# EAGLE design Pyr0-Piezo_Direct-Extruder-FFC-Breakout_2.1.1 (EAGLE 9.4.2)
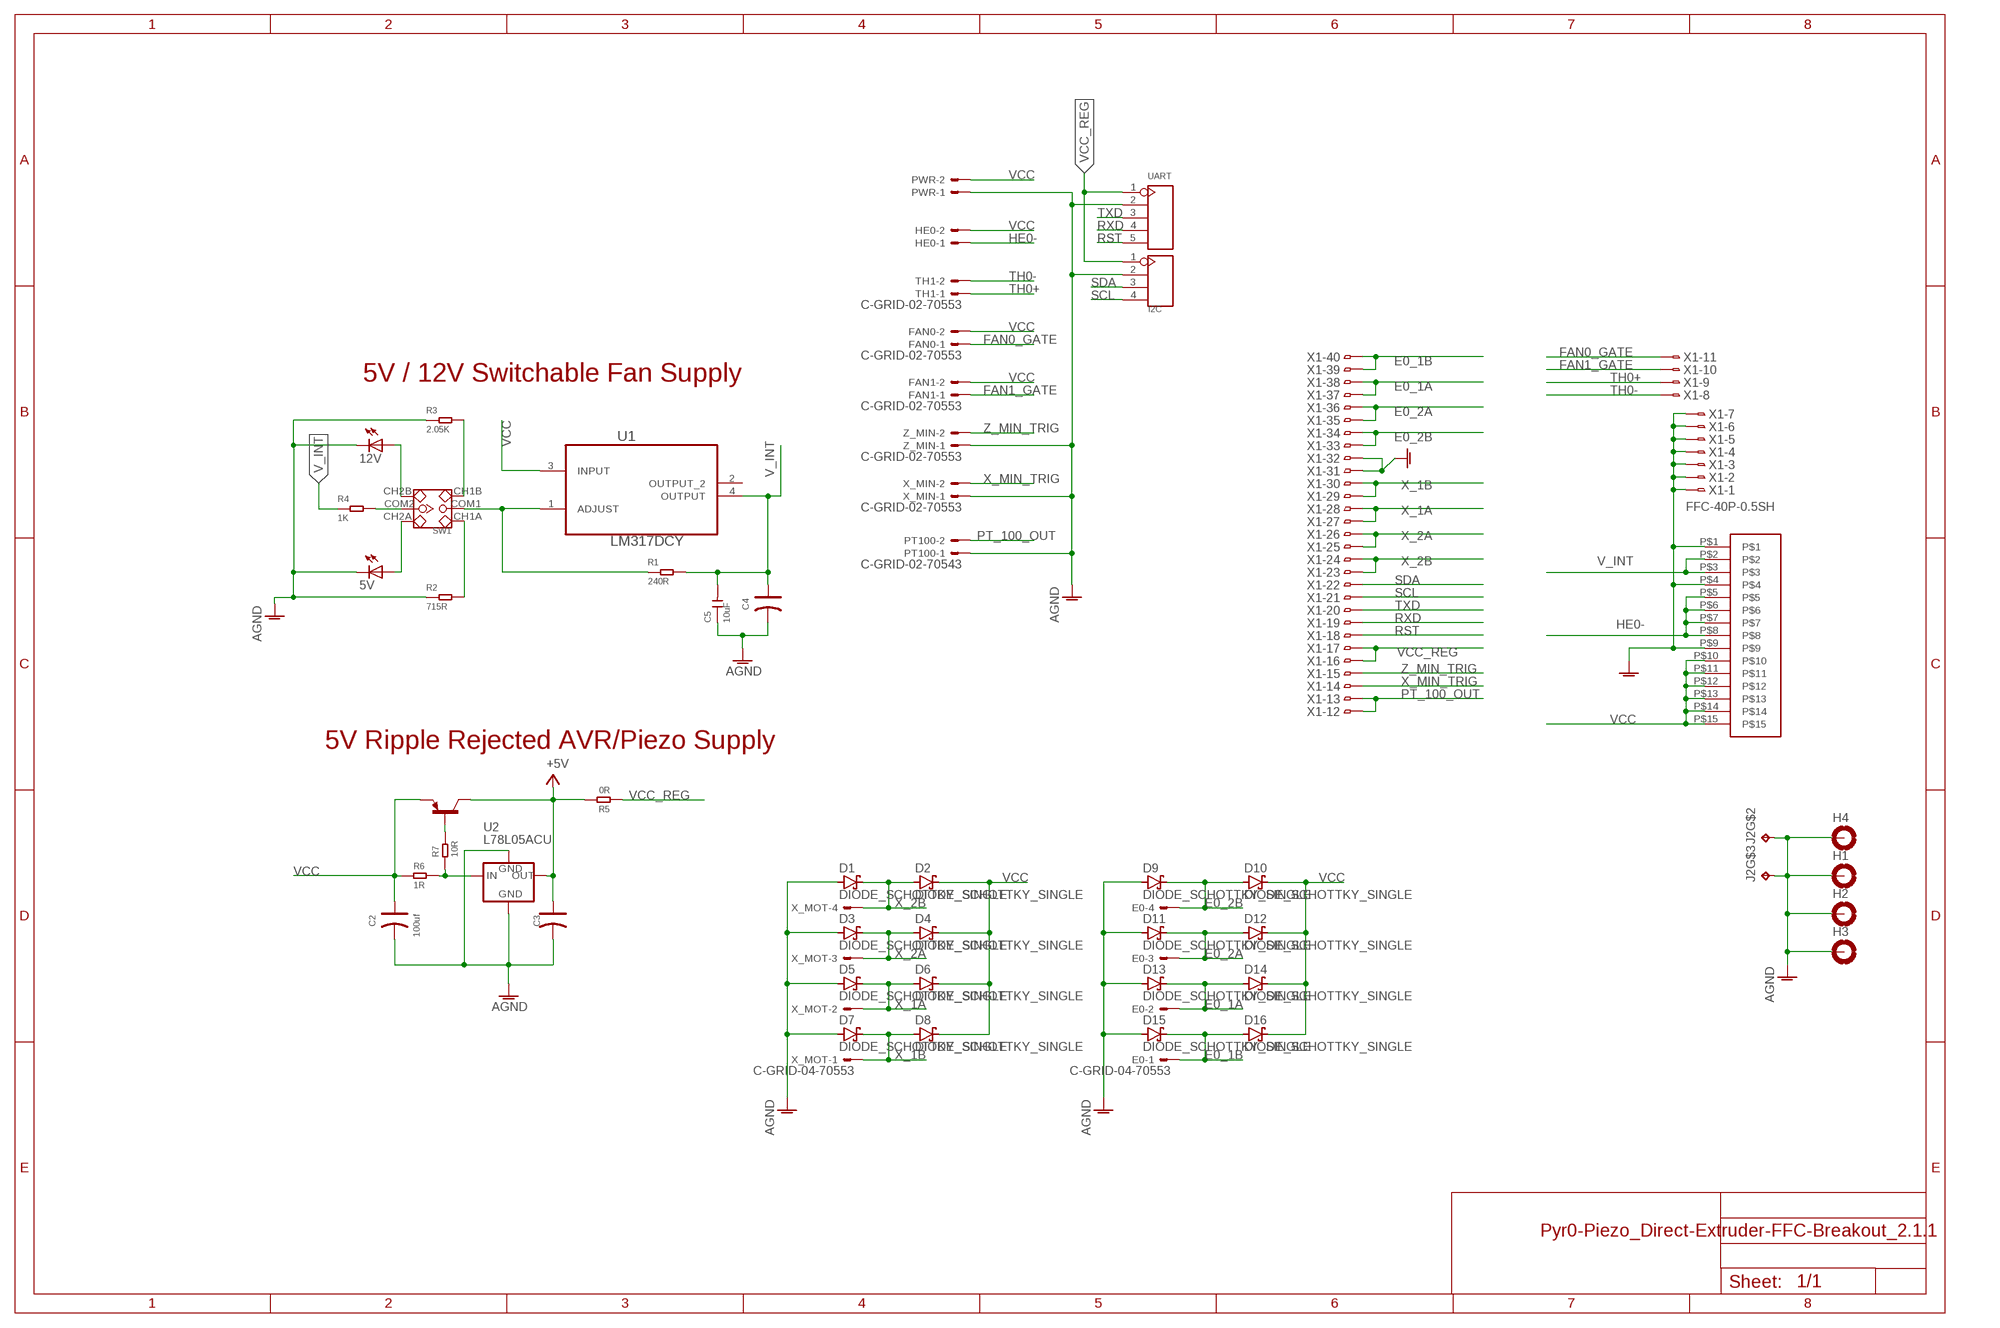
[diagram p0: schematic, sheet 1]

## Parts
5V  LEDCHIP-LED0805  [CHIP-LED0805]
12V  LEDCHIP-LED0805  [CHIP-LED0805]
C2  100uf  DIP-ALUMINUM-100UF-16V(D5-H7MM)LEFT  [ALU-C-D5.3MM_LEFT]
C3  100uf  DIP-ALUMINUM-100UF-16V(D5-H7MM)RIGHT  [ALU-C-D5.3MM_RIGHT]
C4  100uf  DIP-ALUMINUM-100UF-16V(D5-H7MM)RIGHT  [ALU-C-D5.3MM_RIGHT]
C5  10uF  SEEED-CAPACITOR_CERAMIC-10UF-25V-10%-X5R(0805)CAP_0805-3D  [CAPC2012X130]
D1  DIODE_SCHOTTKY_SINGLE  [DO-214AC]
D2  DIODE_SCHOTTKY_SINGLE  [DO-214AC]
D3  DIODE_SCHOTTKY_SINGLE  [DO-214AC]
D4  DIODE_SCHOTTKY_SINGLE  [DO-214AC]
D5  DIODE_SCHOTTKY_SINGLE  [DO-214AC]
D6  DIODE_SCHOTTKY_SINGLE  [DO-214AC]
D7  DIODE_SCHOTTKY_SINGLE  [DO-214AC]
D8  DIODE_SCHOTTKY_SINGLE  [DO-214AC]
D9  DIODE_SCHOTTKY_SINGLE  [DO-214AC]
D10  DIODE_SCHOTTKY_SINGLE  [DO-214AC]
D11  DIODE_SCHOTTKY_SINGLE  [DO-214AC]
D12  DIODE_SCHOTTKY_SINGLE  [DO-214AC]
D13  DIODE_SCHOTTKY_SINGLE  [DO-214AC]
D14  DIODE_SCHOTTKY_SINGLE  [DO-214AC]
D15  DIODE_SCHOTTKY_SINGLE  [DO-214AC]
D16  DIODE_SCHOTTKY_SINGLE  [DO-214AC]
E0  C-GRID-04-70553  [70553-04]
FAN0  C-GRID-02-70553  [70553-02]
FAN1  C-GRID-02-70553  [70553-02]
H1  HOLES_MOUNT-PAD-ROUND3.2  [HOLES_3,2-PAD]
H2  HOLES_MOUNT-PAD-ROUND3.2  [HOLES_3,2-PAD]
H3  HOLES_MOUNT-PAD-ROUND3.2  [HOLES_3,2-PAD]
H4  HOLES_MOUNT-PAD-ROUND3.2  [HOLES_3,2-PAD]
HE0  KK-156-2  [KK-156-2]
I2C  SEEED-CONNECTOR_DIP-BLACK-FEMALE-HEADER-VERT(4P-2.54)JST-2.54MM_4P  [HDRVR4W64P254_1X4_1016X254X575B]
J2  FFC-15P-1MM  [FFC-15P-1MM]
PT100  C-GRID-02-70543  [70543-02]
PWR  KK-156-2  [KK-156-2]
Q2  MMBT2907ALT1-PNP-SOT23-BEC  [SOT23-BEC]
R1  240R  SEEED-RESISTOR_SMD-RES-1.5K-1%-1/10W(0603)DETAILED_MODEL  [SEEED-RESISTOR_R0603]
R2  715R  SEEED-RESISTOR_SMD-RES-1.5K-1%-1/10W(0603)DETAILED_MODEL  [SEEED-RESISTOR_R0603]
R3  2.05K  SEEED-RESISTOR_SMD-RES-1.5K-1%-1/10W(0603)DETAILED_MODEL  [SEEED-RESISTOR_R0603]
R4  1K  SEEED-RESISTOR_SMD-RES-1.5K-1%-1/10W(0603)DETAILED_MODEL  [SEEED-RESISTOR_R0603]
R5  0R  SMD-RES-2K-5%-1/8W(0805)  [R0805]
R6  1R  SMD-RES-2K-5%-1/8W(0805)  [R0805]
R7  10R  SMD-RES-2K-5%-1/8W(0805)  [R0805]
SW1  SEEED-SWITCH_DIP-TOGGLE-SWITCH-2CH-(2X3P-2.54)DPDT_254_6P_UPDATE  [SEEED-SWITCH_SW6-2.54-9.0X3.5X3.2+2.0MM]
TH1  C-GRID-02-70553  [70553-02]
U1  LM317DCY  [SOT230P700X180-4N]
U2  L78L05ACU  [SOT89]
UART  JST-2.54MM_5P-2.54JST_2.54MM_5P_F  [HDRVR5W64P254_1X5_1270X254X575B]
X1  FFC-40P-0.5SH  [FH12-40S-0.5SH]
X_MIN  C-GRID-02-70553  [70553-02]
X_MOT  C-GRID-04-70553  [70553-04]
Z_MIN  C-GRID-02-70553  [70553-02]

## Nets
5V_ADJ: R2.2 SW1.CH1A
5V_LED: 5V.A SW1.CH2A
12V_ADJ: R3.2 SW1.CH1B
12V_LED: 12V.A SW1.CH2B
+5V: C3.+ Q2.C R5.2 U2.1(OUT)
AGND: 5V.C 12V.C C2.- C3.- C4.- C5.1 D1.A D3.A D5.A D7.A D9.A D11.A D13.A D15.A H1.B3,2(MOUNT) H2.B3,2(MOUNT) H3.B3,2(MOUNT) H4.B3,2(MOUNT) I2C.2 J2.P$1 J2.P$4 J2.P$9 J2.P$16(TP) J2.P$17(TP) PT100.1 PWR.1 R2.1 R3.1 U2.2(GND) U2.PAD UART.2 X1.1 X1.2 X1.3 X1.4 X1.5 X1.6 X1.7 X1.31 X1.32 X_MIN.1 Z_MIN.1
BYP_GATE: Q2.B R7.2
E0_1A: D13.C D14.A E0.2 X1.37 X1.38
E0_1B: D15.C D16.A E0.1 X1.39 X1.40
E0_2A: D11.C D12.A E0.3 X1.35 X1.36
E0_2B: D9.C D10.A E0.4 X1.33 X1.34
FAN0_GATE: FAN0.1 X1.11
FAN1_GATE: FAN1.1 X1.10
HE0-: HE0.1 J2.P$5 J2.P$6 J2.P$7 J2.P$8
LED_R: R4.2 SW1.COM2
LM317_VADJ: R1.1 SW1.COM1 U1.1(ADJUST)
PT_100_OUT: PT100.2 X1.12 X1.13
RST: UART.5 X1.18
RXD: UART.4 X1.19
SCL: I2C.4 X1.21
SDA: I2C.3 X1.22
TH0+: TH1.1 X1.9
TH0-: TH1.2 X1.8
TXD: UART.3 X1.20
V_INT: C4.+ C5.2 J2.P$2 J2.P$3 R1.2 R4.1 U1.4(OUTPUT)
VCC: C2.+ D2.C D4.C D6.C D8.C D10.C D12.C D14.C D16.C FAN0.2 FAN1.2 HE0.2 J2.P$10 J2.P$11 J2.P$12 J2.P$13 J2.P$14 J2.P$15 PWR.2 Q2.E R6.1 U1.3(INPUT)
VCC_REG: I2C.1 R5.1 UART.1 X1.16 X1.17
VREG_IN: R6.2 R7.1 U2.3(IN)
X_1A: D5.C D6.A X1.27 X1.28 X_MOT.2
X_1B: D7.C D8.A X1.29 X1.30 X_MOT.1
X_2A: D3.C D4.A X1.25 X1.26 X_MOT.3
X_2B: D1.C D2.A X1.23 X1.24 X_MOT.4
X_MIN_TRIG: X1.14 X_MIN.2
Z_MIN_TRIG: X1.15 Z_MIN.2
Unconnected: U1.2(OUTPUT_2)

## Notes on the sheet
- 5V / 12V Switchable Fan Supply
- 5V Ripple Rejected AVR/Piezo Supply

## Library data of the parts
5V 12V = PiezoFFC:LED: LED OSRAM: - CHIPLED LG R971, LG N971, LY N971, LG Q971, LY Q971, LO R971, LY R971 LH N974, LH R974 LS Q976, LO Q976, LY Q976 LO Q996 - Hyper CHIPLED LW Q18S LB Q993, LB Q99A, LB R99A - SideLED LS A670, LO A670, LY A670, LG A670, LP A670 LB A673, LV A673, LT A673, LW A673 LH A674 LY A675 LS A676, LA A676, LO A676, LY A676, LW A676 LS A679, LY A679, LG A679 - Hyper Micro SIDELED® LS Y876, LA Y876, LO Y876, LY Y876 LT Y87S - SmartLED LW L88C, LW L88S LB L89C, LB L89S, LG L890 LS L89K, LO L89K, LY L89K LS L896, LA L896, LO L896, LY L896 - TOPLED LS T670, LO T670, LY T670, LG T670, LP T670 LSG T670, LSP T670, LSY T670, LOP T670, LYG T670 LG T671, LOG T671, LSG T671 LB T673, LV T673, LT T673, LW T673 LH T674 LS T676, LA T676, LO T676, LY T676, LB T676, LH T676, LSB T676, LW T676 LB T67C, LV T67C, LT T67C, LS T67K, LO T67K, LY T67K, LW E67C LS E67B, LA E67B, LO E67B, LY E67B, LB E67C, LV E67C, LT E67C LW T67C LS T679, LY T679, LG T679 LS T770, LO T770, LY T770, LG T770, LP T770 LB T773, LV T773, LT T773, LW T773 LH T774 LS E675, LA E675, LY E675, LS T675 LS T776, LA T776, LO T776, LY T776, LB T776 LHGB T686 LT T68C, LB T68C - Hyper Mini TOPLED® LB M676 - Mini TOPLED Santana® LG M470 LS M47K, LO M47K, LY M47K Source: http://www.osram.convergy.de LUXEON: - LUMILED® LXK2-PW12-R00, LXK2-PW12-S00, LXK2-PW14-U00, LXK2-PW14-V00 LXK2-PM12-R00, LXK2-PM12-S00, LXK2-PM14-U00 LXK2-PE12-Q00, LXK2-PE12-R00, LXK2-PE12-S00, LXK2-PE14-T00, LXK2-PE14-U00 LXK2-PB12-K00, LXK2-PB12-L00, LXK2-PB12-M00, LXK2-PB14-N00, LXK2-PB14-P00, LXK2-PB14-Q00 LXK2-PR12-L00, LXK2-PR12-M00, LXK2-PR14-Q00, LXK2-PR14-R00 LXK2-PD12-Q00, LXK2-PD12-R00, LXK2-PD12-S00 LXK2-PH12-R00, LXK2-PH12-S00 LXK2-PL12-P00, LXK2-PL12-Q00, LXK2-PL12-R00 Source: www.luxeon.com KINGBRIGHT: KA-3528ASYC Source: www.kingbright.com
C2 = PiezoFFC:DIP-ALUMINUM-100UF-16V(D5-H7MM): 302030031; MPN: KS 100uF/16V
C3 C4 = PiezoFFC:DIP-ALUMINUM-100UF-16V(D5-H7MM): 302030031
C5 = PiezoFFC:SEEED-CAPACITOR_CERAMIC-10UF-25V-10%-X5R(0805): 302010178
D1-D16 = PiezoFFC:DIODE_SCHOTTKY_SINGLE
E0 X_MOT = PiezoFFC:C-GRID-04: CONNECTOR wire to board 2.54 mm (0.100") pitch header; MF: MOLEX; OC_FARNELL: unknown; OC_NEWARK: unknown
FAN0 FAN1 PT100 TH1 X_MIN Z_MIN = PiezoFFC:C-GRID-02: CONNECTOR wire to board 2.54 mm (0.100") pitch header; MF: MOLEX; OC_FARNELL: unknown; OC_NEWARK: unknown
H1-H4 = PiezoFFC:HOLES_MOUNT-PAD-ROUND: MOUNTING PAD, round
HE0 PWR = PiezoFFC:KK-156-2: KK 156 HEADER Source: http://www.molex.com/pdm_docs/sd/026604100_sd.pdf; MF: MOLEX; OC_FARNELL: unknown; OC_NEWARK: unknown
I2C = PiezoFFC:SEEED-CONNECTOR_DIP-BLACK-FEMALE-HEADER-VERT(4P-2.54): 320030017
J2 = PiezoFFC:FFC-15P-1MM
Q2 = PiezoFFC:*-PNP-: PNP Transistror
R1-R4 = PiezoFFC:SEEED-RESISTOR_SMD-RES-1.5K-1%-1/10W(0603): 301010189
R5-R7 = PiezoFFC:SMD-RES-2K-5%-1/8W(0805): 301010318; MPN: RC0805JR-072KL; VALUE: 2K
SW1 = PiezoFFC:SEEED-SWITCH_DIP-TOGGLE-SWITCH-2CH-(2X3P-2.54): 311010004
U1 = PiezoFFC:LM317DCY: IC ADJ LINEAR REG 1.25V TO 37V; AVAILABILITY: Unavailable; DESCRIPTION: IC Regulator LM317/SOT223/LM317DCY TEXAS INSTRUMENT RoHS Ampere=1.5 SOT223; MF: Texas Instruments; MP: LM317DCY; PACKAGE: SOT-223-4 Texas Instruments; PRICE: None
U2 = PiezoFFC:L78L05ACU: 5V Positive voltage regulator SMD SOT89 Package; AVAILABILITY: Unavailable; DESCRIPTION: Voltage regulator; fixed; 5V; 0.1A; SOT89; SMD; Package: reel, tape; MF: STMicroelectronics; MP: L78L05ACU-TR; PACKAGE: None; PRICE: None
UART = PiezoFFC:JST-2.54MM_5P-2.54
X1 = PiezoFFC:FFC-40P-0.5S: 0.5mm Pitch Connectors For FPC/FFC Source: Data sheet <http://www.hirose.co.jp/cataloge_hp/e58605370.pdf>; MPN: FH12-40S-0.5SH(55); OC_FARNELL: 1324556; OC_NEWARK: 34M6178

## Board
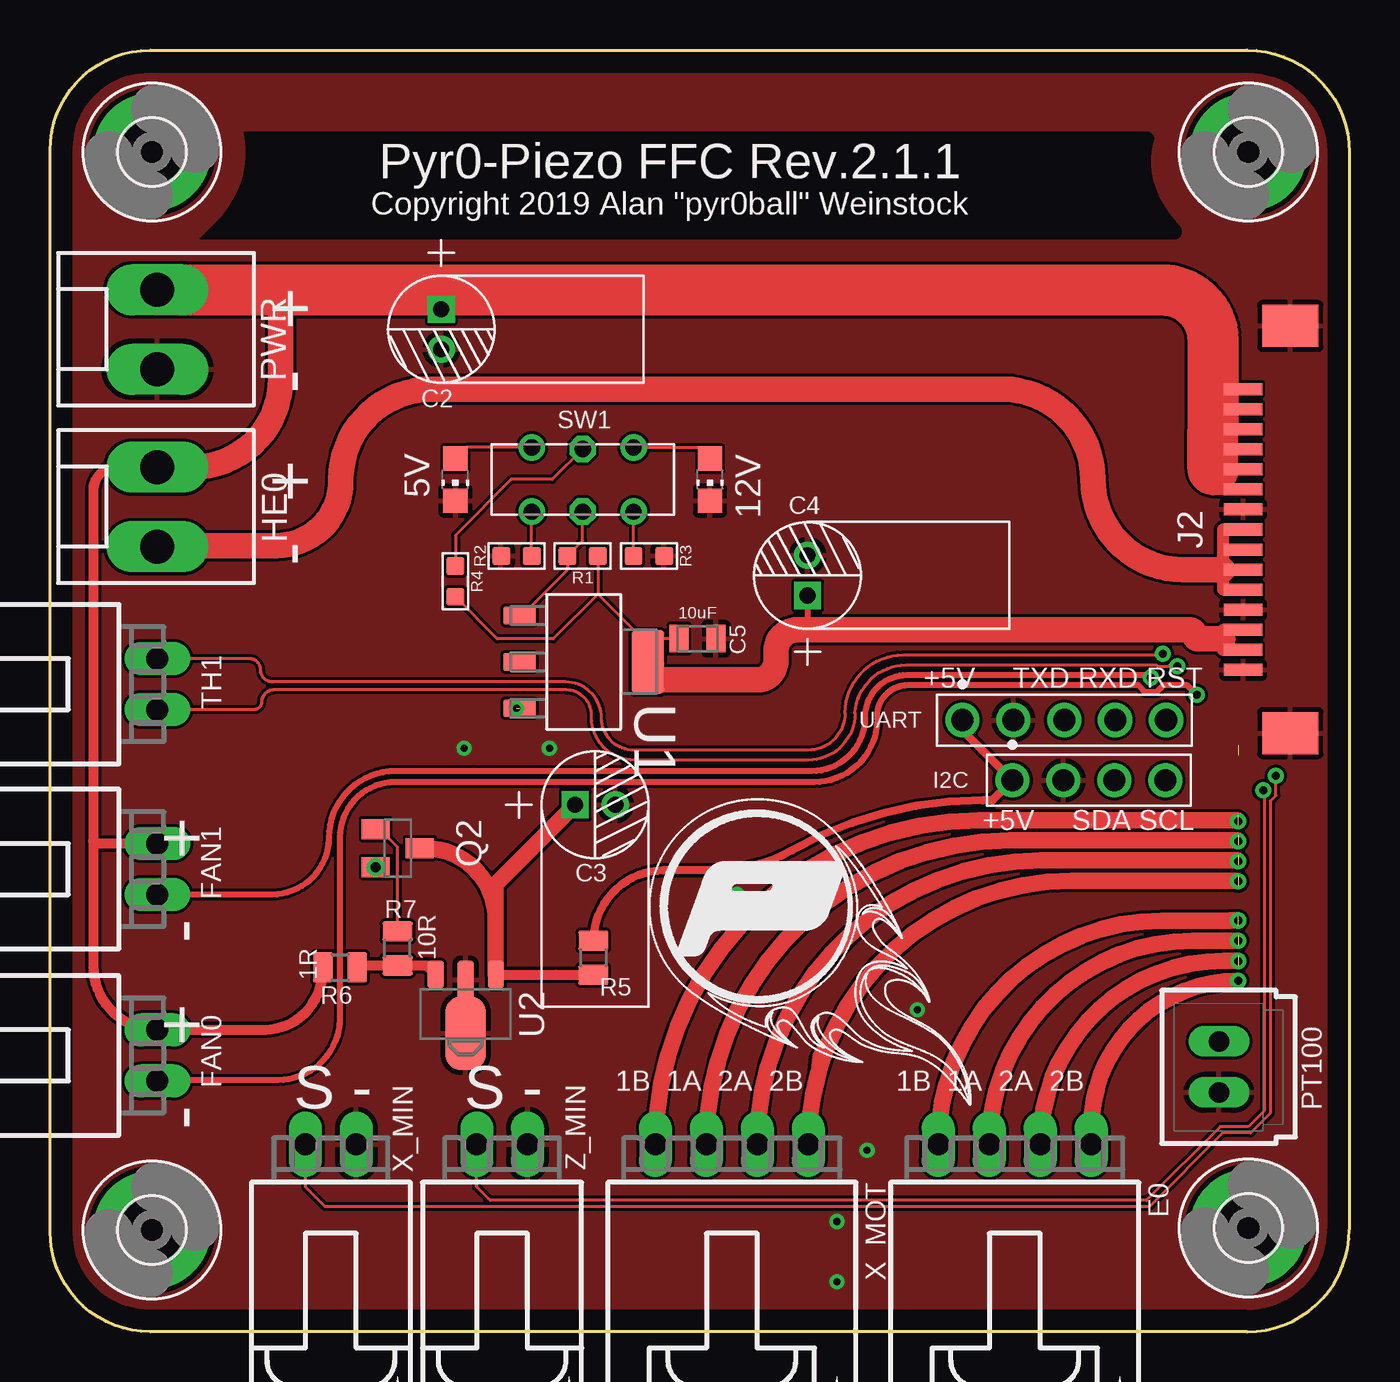
[diagram p1: board, top side]
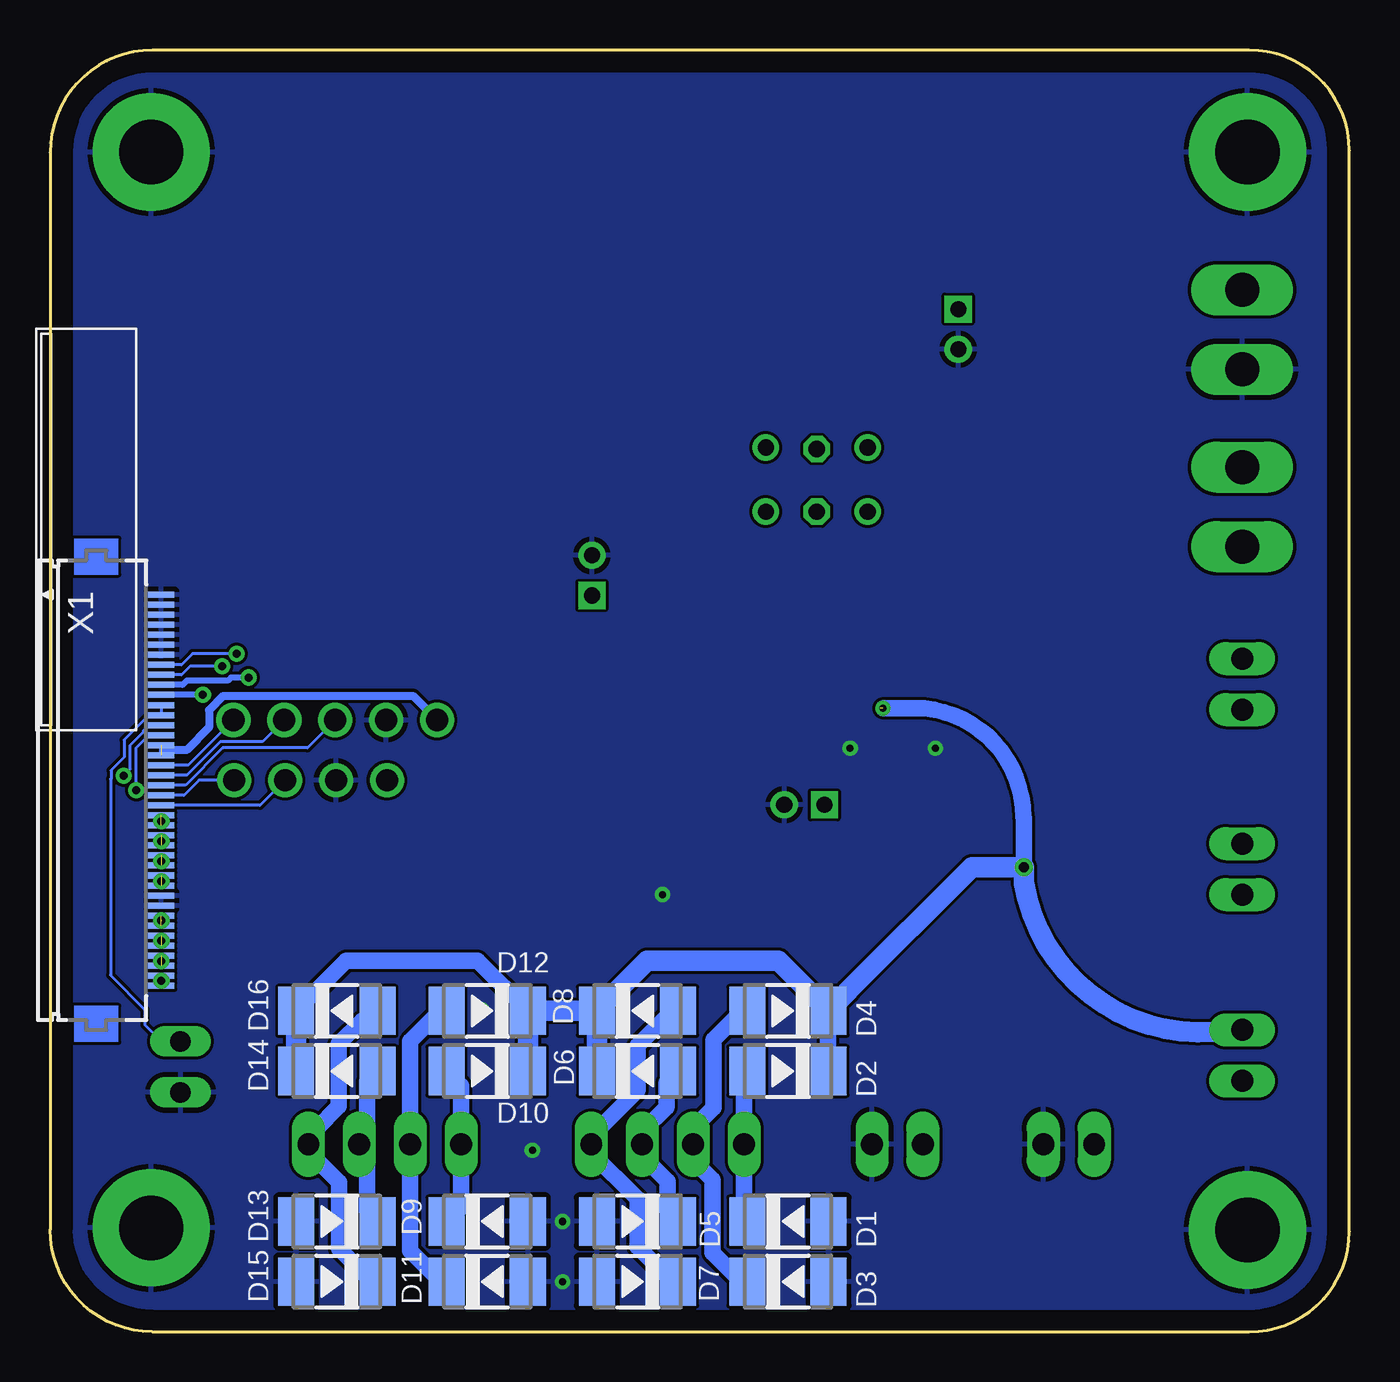
[diagram p2: board, bottom side, seen from below]

Size 64.8 x 63.9 mm. Coordinates in mm from the lower left corner, seen from the top.
Outline: 59.7,0 5,0 arc-90 0,5 0,58.9 arc-90 5,63.9 59.7,63.9 arc-90 64.8,58.8 64.8,5.1 arc-90 59.7,0
Copper layers (1*16): Top 0.035mm / dielectric 1.5mm / Bottom 0.035mm
Design rules "default": minimum track width 6mil, minimum drill 0.35mm, track to track 6mil, track to pad 6mil, pad to pad 6mil, via to via 6mil, smd to smd 6mil, copper to edge 40mil, drill to drill 6mil, minimum pad ring 10mil, minimum via ring 8mil, stop-mask expansion 4mil, vias tented up to drill 0mil, thermal gap 10mil

### Footprints (pad centres in the part's own frame; a part is rotated, then mirrored left to right if it is on the bottom)
CHIP-LED0805 = smd 1.2 x 1.2: A 0,-1.05; C 0,1.05
ALU-C-D5.3MM_LEFT = drill 0.8 pad 1.35 square: + -1,0 | drill 0.8 pad 1.35: - 1,0
ALU-C-D5.3MM_RIGHT = drill 0.8 pad 1.35 square: + -1,0 | drill 0.8 pad 1.35: - 1,0
CAPC2012X130 = smd 0.962 x 1.362: 1 -0.925,0; 2 0.925,0
DO-214AC = smd 1.8 x 2.4: A 2.025,0; C -2.025,0
70553-04 = drill 1.092 long: 1 -3.81,-7.62; 2 -1.27,-7.62; 3 1.27,-7.62; 4 3.81,-7.62
70553-02 = drill 1.092 long: 1 -1.27,-7.62; 2 1.27,-7.62
HOLES_3,2-PAD = drill 3.2 pad 5.842: B3,2 0,0
KK-156-2 = drill 1.7 pad 2.184 long: 1 -1.98,0; 2 1.98,0
HDRVR4W64P254_1X4_1016X254X575B = drill 1.105 pad 1.705: 1 0,0; 2 2.54,0; 3 5.08,0; 4 7.62,0
FFC-15P-1MM = smd 0.6 x 1.9: P$1 0,0; P$2 1,0; P$3 2,0; P$4 3,0; P$5 4,0; P$6 5,0; P$7 6,0; P$8 7,0; P$9 8,0; P$10 9,0; P$11 10,0; P$12 11,0; P$13 12,0; P$14 13,0; P$15 14,0 | smd 2.1 x 2.8: P$16 -3.15,-2.35; P$17 17.15,-2.35
70543-02 = drill 1.016 long: 1 -1.27,0; 2 1.27,0
SOT23-BEC = smd 1 x 1.4: B -0.95,-1.1; C 0,1.1; E 0.95,-1.1
SEEED-RESISTOR_R0603 = smd 0.889 x 0.889: 1 0,0.762; 2 0,-0.762
R0805 = smd 1 x 1.5: 1 -0.85,0; 2 0.85,0
SEEED-SWITCH_SW6-2.54-9.0X3.5X3.2+2.0MM = drill 0.813 pad 1.27: CH1A -2.54,-1.6; CH1B 2.54,-1.6; CH2A -2.54,1.6; CH2B 2.54,1.6 | drill 0.813 pad 1.27 octagon: COM1 0,-1.6; COM2 0,1.524
SOT230P700X180-4N = smd 1.626 x 0.889: 1 -3.2,2.311; 2 -3.2,0; 3 -3.2,-2.311 | smd 1.626 x 3.175: 4 3.2,0
SOT89 = smd 0.8 x 1.4: 1 -1.499,-1.981; 3 1.499,-1.981 | smd 0.8 x 1.9: 2 0,-1.727 | smd 2.032 x 3.65: PAD 0,0.94
HDRVR5W64P254_1X5_1270X254X575B = drill 1.105 pad 1.705: 1 0,0; 2 2.54,0; 3 5.08,0; 4 7.62,0; 5 10.16,0
FH12-40S-0.5SH = smd 0.3 x 1.3: 1 -9.75,3.25; 2 -9.25,3.25; 3 -8.75,3.25; 4 -8.25,3.25; 5 -7.75,3.25; 6 -7.25,3.25; 7 -6.75,3.25; 8 -6.25,3.25; 9 -5.75,3.25; 10 -5.25,3.25; 11 -4.75,3.25; 12 -4.25,3.25; 13 -3.75,3.25; 14 -3.25,3.25; 15 -2.75,3.25; 16 -2.25,3.25; 17 -1.75,3.25; 18 -1.25,3.25; 19 -0.75,3.25; 20 -0.25,3.25; 21 0.25,3.25; 22 0.75,3.25; 23 1.25,3.25; 24 1.75,3.25; 25 2.25,3.25; 26 2.75,3.25; 27 3.25,3.25; 28 3.75,3.25; 29 4.25,3.25; 30 4.75,3.25; 31 5.25,3.25; 32 5.75,3.25; 33 6.25,3.25; 34 6.75,3.25; 35 7.25,3.25; 36 7.75,3.25; 37 8.25,3.25; 38 8.75,3.25; 39 9.25,3.25; 40 9.75,3.25

### Placement (x,y rotation side)
5V  20.21,42.49 180 top
12V  32.91,42.49 180 top
C2  19.51,49.99 270 top
C3  27.19,26.27 0 top
C4  37.78,37.71 90 top
C5  32.29,34.56 180 top
D1  28,5.5 0 bottom
D2  28,13 180 bottom
D3  28,2.5 0 bottom
D4  28,16 180 bottom
D5  35.5,5.5 180 bottom
D6  35.5,13 0 bottom
D7  35.5,2.5 180 bottom
D8  35.5,16 0 bottom
D9  43,5.5 0 bottom
D10  43,13 180 bottom
D11  43,2.5 0 bottom
D12  43,16 180 bottom
D13  50.5,5.5 180 bottom
D14  50.5,13 0 bottom
D15  50.5,2.5 180 bottom
D16  50.5,16 0 bottom
E0  48.11,1.73 180 top
FAN0  -2.27,13.78 90 top
FAN1  -2.27,23.07 90 top
H1  5.08,5.08 0 top
H2  5.08,58.82 0 top
H3  59.76,5.18 0 top
H4  59.76,58.82 0 top
HE0  5.35,41.13 90 top
I2C  48,27.5 0 top
J2  59.5,33 90 top
PT100  58.29,13.21 90 top
PWR  5.35,49.97 90 top
Q2  17.34,24.11 270 top
R1  26.56,38.68 90 top
R2  23.26,38.68 90 top
R3  29.86,38.68 270 top
R4  20.21,37.41 180 top
R5  27.1,18.65 270 top
R6  14.46,18.17 0 top
R7  17.33,19.11 90 top
SW1  26.56,42.49 0 top
TH1  -2.27,32.29 90 top
U1  26.61,33.4 0 top
U2  20.72,15.83 180 top
U$1  [LOGO-PYR0BALL]  24.65,11 0 top
UART  45.5,30.5 0 top
X1  62.5,27 270 bottom
X_MIN  14,1.73 180 top
X_MOT  34,1.73 180 top
Z_MIN  22.54,1.73 180 top

### Tracks (layer width: path | path; a pad name or v marks a point on that pad's centre or on a via)
5V_ADJ
  Top 0.152: R2.2 SW1.CH1A
5V_LED
  Top 0.152: SW1.CH2A 20.76,44.09 arc90 5V.A
12V_ADJ
  Top 0.152: R3.2 SW1.CH1B
12V_LED
  Top 0.152: SW1.CH2B 32.36,44.09 arc-90 12V.A
+5V
  Top 0.152: 25.23,17.98 arc90 25.2,17.95 25.2,17.8
  Top 0.508: U2.1 arc90 22.23,17.8 25.2,17.8 R5.2
  Top 0.813: Q2.C arc-90 22.22,20.77 | 22.22,20.77 U2.1 | C3.+ 22.22,22.31 22.22,20.77
AGND  (via drill 0.35)
  other vias: 39.25,2.5 43.25,16.05 40.75,9.05 39.25,5.5 34.25,21.8 24.9,29.1 20.65,29.1
  pour Top: 0.76,4.95 0.76,58.82 arc-90 5.08,63.14 59.76,63.14 arc-90 64.08,58.82 64.08,5.18 arc-90 59.66,0.76 4.95,0.76 arc-90
  pour Bottom: 0.8,5 0.8,58.8 arc-90 5.1,63.1 59.7,63.1 arc-90 64,58.8 64,5.1 arc-90 59.7,0.8 5,0.8 arc-90
  cutout Top: 7.5,54.5 8.4,55.4 arc57 9.7,59.8 54.7,59.8 arc-106 55,59.4 arc33 55,57.3 arc29 56.3,55.1 arc-127 56.1,54.5
BYP_GATE
  Top 0.152: R7.2 17.33,24.17 16.44,25.06 Q2.B
E0_1A  (via drill 0.4)  (3 unrouted)
  Top 0.813: E0.2 arc-90 58.53,18.5 59.21,18.5 59.25,18.46 59.25,18.5
  Bottom 0.813: D14.A 48.98,12.49 48.98,9.75 E0.2 48.98,8.95 48.98,6 D13.C
  other vias: 59.25,18.48
E0_1B  (via drill 0.4)
  Top 0.813: v59.25,17.5 arc90 51.92,10.17 E0.1
  Bottom 0.152: X1.39 v59.25,17.5
  Bottom 0.203: v59.25,17.5 X1.40
  Bottom 0.813: D16.A 48.98,15.5 49.25,15.5 50.4,14.35 50.4,11.25 51.52,10.13 51.52,9.75 E0.1 51.52,8.95 51.52,8.57 50.4,7.45 50.4,4.13 48.77,2.5 D15.C
E0_2A  (via drill 0.4)  (2 unrouted)
  Top 0.813: E0.3 arc-90 56.99,19.5 v59.24,19.5 v59.25,19.49
  Bottom 0.813: D11.C 45.3,2.5 46.84,4.04 E0.3 46.84,14.48 45.33,16 D12.A
E0_2B  (via drill 0.4)  (3 unrouted)
  Top 0.813: E0.4 arc-90 55.45,20.5 58.84,20.5 58.85,20.51 v59.25,20.51
  Bottom 0.813: D9.C 45,5.5 44.3,6.2 E0.4 44.3,12.28 D10.A
FAN0_GATE  (via drill 0.4)
  Top 0.305: FAN0.1 arc-90 5.39,12.55 11.35,12.55 arc90 14.45,15.65 14.45,24.65 arc-90 17.2,27.4 38.1,27.4 arc90 41.25,30.55 41.25,30.7 arc-90 42.8,32.25 54.27,32.25 54.61,31.91 55.2,31.91 55.54,32.25 56.69,32.25 v57.18,31.76
  Bottom 0.305: v57.18,31.76 57.49,31.76 57.5,31.75 X1.11
FAN1_GATE  (via drill 0.4)
  Top 0.305: FAN1.1 11.05,21.8 arc90 13.9,24.65 arc-90 17.2,27.95 37.95,27.95 arc90 40.65,30.65 arc-90 42.75,32.75 54.77,32.75 v54.9,32.62
  Bottom 0.305: v54.9,32.62 55.78,32.62 55.93,32.47 57.98,32.47 58.2,32.25 X1.10
HE0-
  Top 0.152: J2.P$7 58.5,39 | J2.P$6 58.5,38
  Top 0.61: J2.P$8 58.5,40 58.5,39 58.5,38 58.5,37 J2.P$5
  Top 1.27: HE0.1 arc90 5.5,39 6,39 arc-90 6.2,39.2 11.3,39.2 arc90 14.5,42.4 14.5,42.5 arc-90 19,47 47.5,47 arc-90 52,42.5 arc90 56.5,38 58.5,38
LED_R
  Top 0.152: SW1.COM2 25.05,42.5 23,42.5 20.21,39.71 R4.2
LM317_VADJ
  Top 0.152: SW1.COM1 26.56,39.44 R1.1 25.8,38 23.51,35.71 U1.1
PT_100_OUT
  Bottom 0.152: X1.12 X1.13 59.28,30.72 59.9,30.72 61.11,29.51 61.11,28.64 61.76,27.99 61.76,27.58 61.78,27.56 61.78,17.78 60.07,16.07 60.07,15.3 59.37,14.61 58.42,14.61 PT100.2
RST
  Bottom 0.152: UART.5 57.91,28.25 X1.18
RXD
  Bottom 0.152: UART.4 54.2,29.42 56.31,29.42 57.98,27.75 X1.19
SCL
  Bottom 0.152: I2C.4 57.37,27.5 58.12,26.75 X1.21
SDA
  Bottom 0.152: I2C.3 54.33,26.25 X1.22
TH0+  (via drill 0.4)
  Top 0.152: TH1.1 10.17,31.02 arc90 10.55,31.4 arc-90 11.15,32 25.75,32 arc-90 27,30.75 27,30.65 arc90 29.15,28.5 37.8,28.5 arc90 40.15,30.85 arc-87 42.69,33.25 55.17,33.25 55.24,33.18 55.76,33.18 55.83,33.25 56.15,33.25 v56.22,33.18
  Bottom 0.152: v56.22,33.18 57.82,33.18 58.25,32.75 X1.9
TH0-  (via drill 0.4)
  Top 0.152: TH1.2 9.94,33.56 arc-90 10.5,33 arc90 11.1,32.4 25.7,32.4 arc-90 27.5,30.6 arc90 29.1,29 37.8,29 arc90 39.65,30.85 arc-90 42.55,33.75 55.44,33.75 v55.5,33.81
  Bottom 0.152: v55.5,33.81 57.69,33.81 58.25,33.25 X1.8
TXD
  Bottom 0.152: UART.3 51.97,29.11 56.18,29.11 58.05,27.25 X1.20
V_INT
  Top 0.152: C5.2 30.06,34.56 arc90 30,34.5 | 30,34.5 30,33.59 arc-90 U1.4 | R1.2 27.32,36.78 | 30,34.5 29.6,34.5 27.32,36.78 | 27.32,36.78 25.09,34.55 22.3,34.55 R4.1
  Top 0.305: 32.21,32.29 arc90 32,32.5 | C4.+ 37.78,35.22 38,35
  Top 0.61: J2.P$3 58.5,35 58.5,34.54 58.5,34 J2.P$2
  Top 1.27: U1.4 arc-90 30,33.21 30,32.5 32,32.5 35.25,32.5 arc90 36.2,33.45 36.2,33.95 arc-90 37.25,35 38,35 56.82,35 arc-90 57.09,34.73 arc90 57.28,34.54 58.5,34.54
VCC  (via drill 0.35, 0.5)  (1 unrouted)
  Top 0.152: C2.+ arc-90 C2.+ 19.5,51.95
  Top 0.305: J2.P$15 58,47 59,46 J2.P$14 | J2.P$13 58,45 59,44 J2.P$12 | J2.P$11 58,43
  Top 0.508: HE0.2 3.31,43.11 arc90 2.15,41.95 2.15,24.5 | 2.15,24.5 2.15,18.25 arc90 FAN0.2 10.73,15.05 arc90 R6.1 | FAN1.2 2.31,24.34 arc-90 2.15,24.5
  Top 0.61: 58,45 58,42 J2.P$10
  Top 1.27: HE0.2 7.11,43.11 arc90 11.5,47.5 11.5,51.95
  Top 2.54: PWR.2 11.5,51.95 19.5,51.95 55.46,51.95 arc-90 58,49.41 58,47 58,45 58,43
  Bottom 0.152: D4.C 26,16
  Bottom 0.305: 23.25,31.1 arc90 v23.26,31.09
  Bottom 0.813: 23.25,31.1 21.7,31.1 arc90 16.27,25.67 16.24,25.64 Q2.E | D2.C 26,13.03 26,16 | D12.C 43.48,18.5 50.02,18.5 D16.C
  Bottom 1.016: FAN0.2 5.92,15.05 arc90 16.24,22.39 Q2.E 18.84,23.16 25,17 25,16.98 D4.C 28.48,18.5 35.02,18.5 D8.C | D8.C D6.C | D8.C D12.C D10.C | D16.C D14.C
  other vias: 16.24,23.16
VCC_REG  (2 unrouted)
  Top 0.406: R5.1 arc-90 30.6,23 33,23 arc31 37,24 arc-29 46.5,26.5 47,26.5 I2C.1 45.5,30 UART.1
  Bottom 0.254: 59,29 X1.16 X1.17
  Bottom 0.406: UART.1 46.71,31.71 56.16,31.71 56.87,31 56.87,30.13 58,29 59,29
VREG_IN
  Top 0.508: R6.2 arc-90 15.4,18.26 R7.1 18.77,18.26 U2.3
X_1A  (via drill 0.4)  (3 unrouted)
  Top 0.813: X_MOT.2 arc-90 49.42,23.5 59.21,23.5 v59.25,23.46
  Bottom 0.813: D6.A 34.07,12.4 34.07,11.2 35.27,10 X_MOT.2 35.37,9.25 35.37,8.87 34,7.5 34,6 33.5,5.5 D5.C
X_1B  (via drill 0.4)  (2 unrouted)
  Top 0.508: X_MOT.1 38.26,13.69 40.5,17.5
  Top 0.813: X_MOT.1 arc-90 50.96,22.5 59.21,22.5 v59.25,22.46
  Bottom 0.813: D7.C 33.77,2.5 35.52,4.25 35.52,6.63 37.81,8.92 X_MOT.1 37.81,9.73 35.5,12.04 35.5,14.25 33.75,16 D8.A
X_2A  (via drill 0.4)  (3 unrouted)
  Top 0.813: X_MOT.3 arc-90 47.88,24.5 59.21,24.5 v59.25,24.46
  Bottom 0.813: D4.A 30.27,16 31.72,14.56 31.72,11.17 32.73,10.15 X_MOT.3 32.73,8.55 31.77,7.59 31.77,3.95 30.32,2.5 D3.C
X_2B  (via drill 0.4)  (3 unrouted)
  Top 0.813: X_MOT.4 arc-90 46.34,25.5 59.21,25.5 v59.25,25.46
  Bottom 0.813: D2.A 30.19,12.84 X_MOT.4 30.19,5.67 D1.C
X_MIN_TRIG  (via drill 0.4)
  Top 0.152: X_MIN.2 12.75,9.33 12.75,7.2 13.71,6.25 54.82,6.25 58.5,9.92 59.88,9.92 60.85,10.89 60.85,26.46 61.13,26.74 v61.13,27.72
  Bottom 0.152: v61.13,27.72 60.8,28.05 60.8,29.25 60.13,29.93 60.13,30 59.87,30.25 X1.14
Z_MIN_TRIG  (via drill 0.4)
  Top 0.152: Z_MIN.2 21.27,7.27 21.25,7.25 21.95,6.55 54.68,6.55 58.36,10.22 59.75,10.22 60.55,11.02 60.55,26.95 v60.5,27
  Bottom 0.152: v60.5,27 60.5,29.12 59.87,29.75 X1.15

### Text on the board
tPlace: Pyr0-Piezo FFC Rev.2.1.1 | Copyright 2019 Alan "pyr0ball" Weinstock | - + | - + | +5V ⏚ TXD RXD RST | +5V ⏚ SDA SCL | - + | S - | S - | 1B 1A 2A 2B | 1B 1A 2A 2B | - +